# EAGLE design MySimpleRFMdongle_rev2 (EAGLE 6.5.0)
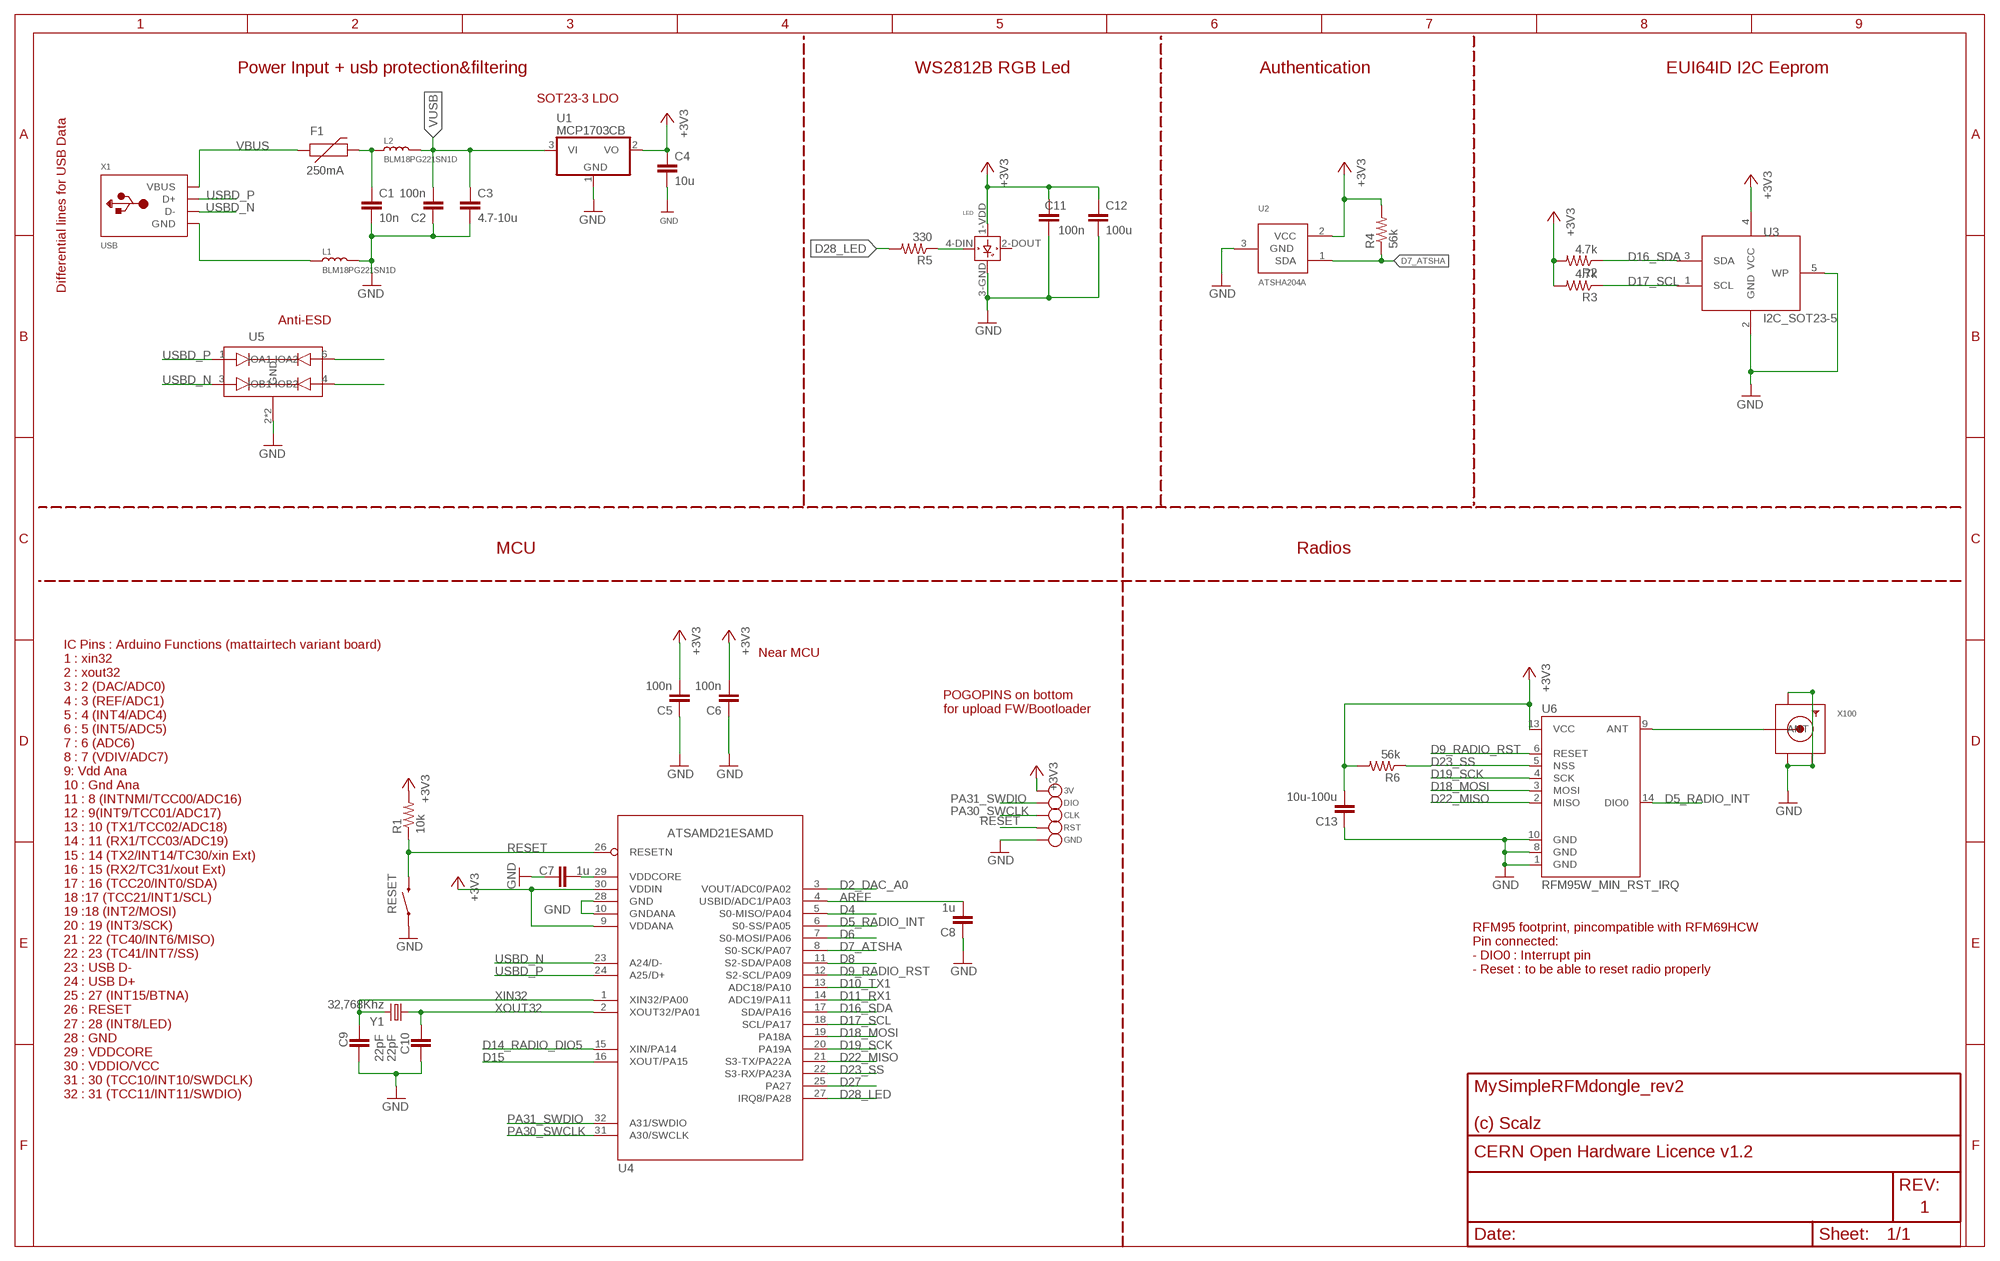
[diagram p0: schematic, sheet 1]

## Parts
3V  TESTPOINTROUND1.5MM  [TESTPOINT_ROUND_1.5MM]
C1  10n  CAP0603-CAP  [0603-CAP]
C2  100n  CAP0603-CAP  [0603-CAP]
C3  4.7-10u  CAP0805-CAP  [0805-CAP]
C4  10u  CAP0805-CAP  [0805-CAP]
C5  100n  CAP0805-CAP  [0805-CAP]
C6  100n  CAP0603-CAP  [0603-CAP]
C7  1u  CAP0805-CAP  [0805-CAP]
C8  1u  CAP0603-CAP  [0603-CAP]
C9  22pF  CAP0603-CAP  [0603-CAP]
C10  22pF  CAP0603-CAP  [0603-CAP]
C11  100n  CAP0603-CAP  [0603-CAP]
C12  100u  CAP0805-CAP  [0805-CAP]
C13  10u-100u  CAP0805-CAP  [0805-CAP]
CLK  TESTPOINTROUND1.5MM  [TESTPOINT_ROUND_1.5MM]
DIO  TESTPOINTROUND1.5MM  [TESTPOINT_ROUND_1.5MM]
F1  250mA  PTCSMD  [PTC-1206]
GND  TESTPOINTROUND1.5MM  [TESTPOINT_ROUND_1.5MM]
L1  BLM18PG221SN1D  INDUCTOR/FERRITE-BEAD-0603  [L0603]
L2  BLM18PG221SN1D  INDUCTOR/FERRITE-BEAD-0603  [L0603]
LED  WS2812B  [WS2812B]
R1  10k  RESISTOR0603-RES  [0603-RES]
R2  4.7k  RESISTOR0603-RES  [0603-RES]
R3  4.7k  RESISTOR0603-RES  [0603-RES]
R4  56k  RESISTOR0603-RES  [0603-RES]
R5  330  RESISTOR0603-RES  [0603-RES]
R6  56k  RESISTOR0603-RES  [0603-RES]
RESET  SWITCH-MOMENTARY-2-SMD-1101NE  [TACTILE-SWITCH-1101NE]
RST  TESTPOINTROUND1.5MM  [TESTPOINT_ROUND_1.5MM]
U1  MCP1703CB  [SOT23]
U2  ATSHA204A  [SOT23]
U3  I2C_SOT23-5  AT24CS32  [SOT-23-5]
U4  ATSAMD21ESAMD  [TQFP32-08]
U5  TPD2E1B06  [TPD2E1B06]
U6  RFM95W_MIN_RST_IRQ  [RFM95W_MINI_RST_IRQ]
X1  USB  [MOLEX-48037-1000]
X100  SMACONNECTOR_EDGE  [SMA_EDGELAUNCH]
Y1  32,768Khz  CRYSTAL2012  [CRYSTAL-SMD-2.0X1.2]

## Nets
+3V3: 3V.P$1 C4.1 C5.2 C6.2 C11.2 C12.1 C13.2 LED.1-VDD(VDD) R1.2 R2.2 R3.2 R4.2 R6.2 U1.2(VO) U2.2(VCC) U3.4(VCC) U4.9(VDDANA) U4.30(VDDIN) U6.13(VCC)
AREF: C8.2 U4.4(USBID/ADC1/PA03)
D2_DAC_A0: U4.3(VOUT/ADC0/PA02)
D4: U4.5(S0-MISO/PA04)
D5_RADIO_INT: U4.6(S0-SS/PA05) U6.14(DIO0)
D6: U4.7(S0-MOSI/PA06)
D7_ATSHA: R4.1 U2.1(SDA) U4.8(S0-SCK/PA07)
D8: U4.11(S2-SDA/PA08)
D9_RADIO_RST: U4.12(S2-SCL/PA09) U6.6(RESET)
D10_TX1: U4.13(ADC18/PA10)
D11_RX1: U4.14(ADC19/PA11)
D14_RADIO_DIO5: U4.15(XIN/PA14)
D15: U4.16(XOUT/PA15)
D16_SDA: R2.1 U3.3(SDA) U4.17(SDA/PA16)
D17_SCL: R3.1 U3.1(SCL) U4.18(SCL/PA17)
D18_MOSI: U4.19(PA18A) U6.3(MOSI)
D19_SCK: U4.20(PA19A) U6.4(SCK)
D22_MISO: U4.21(S3-TX/PA22A) U6.2(MISO)
D23_SS: R6.1 U4.22(S3-RX/PA23A) U6.5(NSS)
D27: U4.25(PA27)
D28_LED: R5.2 U4.27(IRQ8/PA28)
GND: C1.2 C2.1 C3.2 C4.2 C5.1 C6.1 C7.1 C8.1 C9.1 C10.1 C11.1 C12.2 C13.1 GND.P$1 L1.2 LED.3-GND(GND) RESET.P$1 U1.1(GND) U2.3(GND) U3.2(GND) U3.5(WP) U4.10(GNDANA) U4.28(GND) U5.2(GND) U5.5(GND) U6.1(GND) U6.8(GND) U6.10(GND) X100.GND@1(GND4) X100.GND@2(GND3) X100.GND@3(GND2) X100.GND@4(GND1)
N$10: C1.1 F1.2 L2.1
N$12: LED.4-DIN(DIN) R5.1
N$23: U6.9(ANT) X100.P(ANT)
PA30_SWCLK: CLK.P$1 U4.31(A30/SWCLK)
PA31_SWDIO: DIO.P$1 U4.32(A31/SWDIO)
RESET: R1.1 RESET.P$2 RST.P$1 U4.26(RESETN)
USBD_N: U4.23(A24/D-) U5.3(IOB1) U5.4(IOB2) X1.2(D-)
USBD_P: U4.24(A25/D+) U5.1(IOA1) U5.6(IOA2) X1.3(D+)
USBGND: L1.1 X1.4(GND)
VBUS: F1.1 X1.1(VBUS)
VDDCORE: C7.2 U4.29(VDDCORE)
VUSB: C2.2 C3.1 L2.2 U1.3(VI)
XIN32: C9.2 U4.1(XIN32/PA00) Y1.2
XOUT32: C10.2 U4.2(XOUT32/PA01) Y1.1
Unconnected: LED.2-DOUT(DOUT)

## Notes on the sheet
- Power Input + usb protection&filtering | WS2812B RGB Led | Authentication | EUI64ID I2C Eeprom
- SOT23-3 LDO
- Differential lines for USB Data
- Anti-ESD
- MCU | Radios
- Near MCU
- POGOPINS on bottom
  for upload FW/Bootloader
- RFM95 footprint, pincompatible with RFM69HCW
  Pin connected:
  - DIO0 : Interrupt pin
  - Reset : to be able to reset radio properly
- IC Pins : Arduino Functions (mattairtech variant board)
  1 : xin32
  2 : xout32
  3 : 2 (DAC/ADC0)
  4 : 3 (REF/ADC1)
  5 : 4 (INT4/ADC4)
  6 : 5 (INT5/ADC5)
  7 : 6 (ADC6)
  8 : 7 (VDIV/ADC7)
  9: Vdd Ana
  10 : Gnd Ana
  11 : 8 (INTNMI/TCC00/ADC16)
  12 : 9(INT9/TCC01/ADC17)
  13 : 10 (TX1/TCC02/ADC18)
  14 : 11 (RX1/TCC03/ADC19)
  15 : 14 (TX2/INT14/TC30/xin Ext) 
  16 : 15 (RX2/TC31/xout Ext) 
  17 : 16 (TCC20/INT0/SDA)
  18 :17 (TCC21/INT1/SCL)
  19 :18 (INT2/MOSI)
  20 : 19 (INT3/SCK)
  21 : 22 (TC40/INT6/MISO)
  22 : 23 (TC41/INT7/SS)
  23 : USB D- 
  24 : USB D+
  25 : 27 (INT15/BTNA)
  26 : RESET
  27 : 28 (INT8/LED)
  28 : GND
  29 : VDDCORE
  30 : VDDIO/VCC
  31 : 30 (TCC10/INT10/SWDCLK)
  32 : 31 (TCC11/INT11/SWDIO)

## Library data of the parts
3V CLK DIO GND RST = microbuilder:TESTPOINT: Test Point Various test points for characterisation and PCB testing TESTPOINT_SMT - Compact Surface Mount Test Point [Digikey: 5016KTR-ND]
C1-C13 = LowPowerLab:CAP: Capacitor Standard 0603 ceramic capacitor, and 0.1" leaded capacitor.
F1 = SparkFun-PowerIC:PTC: Resettable Fuse PTC Resettable Fuse. Spark Fun Electronics SKU : COM-08357; PROD_ID: RES-11150
L1 L2 = Discrete:INDUCTOR/FERRITE-BEAD
LED = adafruit:WS2812B
R1-R6 = LowPowerLab:RESISTOR: Resistor Basic schematic elements and footprints for 0603, 1206, and PTH resistors.
RESET = SparkFun:SWITCH-MOMENTARY-2
U1 = linear:MCP1703: 250 mA, 16V, Low Quiescent Current LDO Regulator Source: http://ww1.microchip.com/downloads/en/DeviceDoc/22049b.pdf
U2 = rfmdongle:ATSHA204A
U3 = rfmdongle:AT24CS32
U4 = atsamd21E:ATSAMD21E
U5 = rfm_dongle:TPD2E1B06
U6 = rfm_dongle:RFM95W_MIN_RST_IRQ
X1 = todstuff:USB
X100 = rfmdongle:SMACONNECTOR: SMA Connector 90° DIP SMA Connector, 50 Ohm (4UConnector: 07259)
Y1 = SparkFun-FreqCtrl:CRYSTAL: Various standard crystals. Proven footprints. Spark Fun Electronics SKU : COM-00534

## Net classes
0 default: width 0.203 mm, clearance 0.203 mm
1 power: width 0.508 mm, clearance 0.356 mm
2 gnd: width 0.152 mm, drill 0.305 mm, clearance 0.152 mm
4 USBpair: width 0.152 mm, drill 0.305 mm, clearance 0.152 mm

## Board
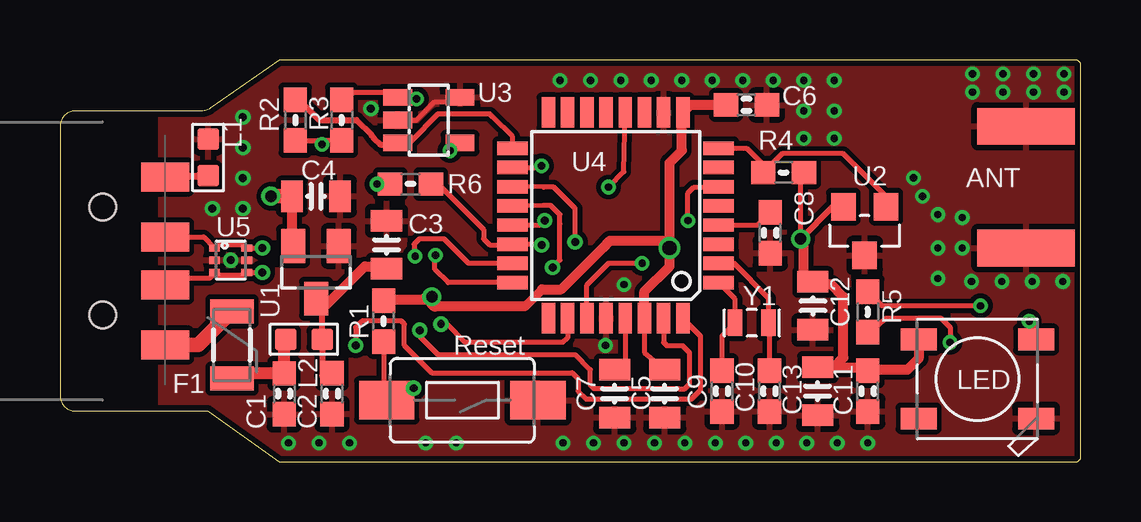
[diagram p1: board, top side]
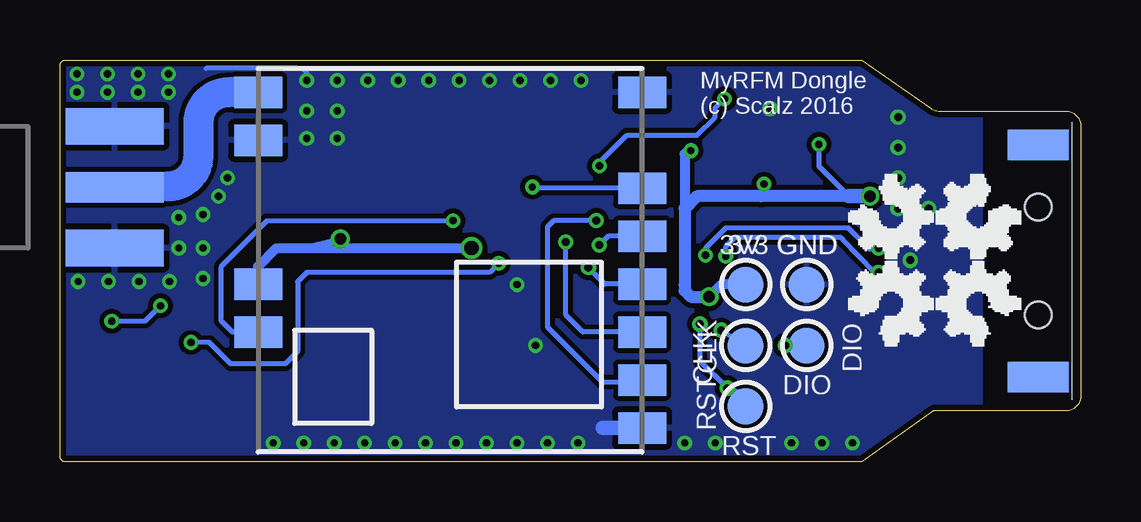
[diagram p2: board, bottom side, seen from below]

Size 42.54 x 16.77 mm. Coordinates in mm from the lower left corner, seen from the top.
Outline: 0,14.01 0,2.76 arc90 0.64,2.13 6.16,2.13 9.14,0 42.29,0 arc90 42.54,0.25 42.54,16.52 arc90 42.29,16.77 9.14,16.77 6.26,14.76 arc-35 5.9,14.64 0.64,14.64 arc90 0,14.01
Copper layers (1*16): Top 0.035mm / dielectric 1.5mm / Bottom 0.035mm
Design rules "SeeedStudio_2layer_DRU_no_angle_20140221": minimum track width 6mil, minimum drill 12mil, track to track 6mil, track to pad 6mil, pad to pad 6mil, via to via 6mil, smd to smd 0mil, copper to edge 10mil, drill to drill 10mil, minimum pad ring 10mil, minimum via ring 6mil, stop-mask expansion 2mil, vias tented up to drill 100mil, thermal gap 10mil

### Footprints (pad centres in the part's own frame; a part is rotated, then mirrored left to right if it is on the bottom)
TESTPOINT_ROUND_1.5MM = smd 1.5 x 1.5: P$1 0,0
0603-CAP = smd 1.016 x 0.965: 1 -0.85,0; 2 0.85,0
0805-CAP = smd 0.902 x 1.3: 1 -1,0; 2 1,0
PTC-1206 = smd 1 x 1.8: 1 -1.4,0; 2 1.4,0
L0603 = smd 0.889 x 0.889: 1 -0.762,0; 2 0.762,0
WS2812B = smd 1.5 x 0.9: 1-VDD 2.45,-1.65; 2-DOUT 2.45,1.65; 3-GND -2.45,1.65; 4-DIN -2.45,-1.65
0603-RES = smd 1.016 x 0.965: 1 -0.85,0; 2 0.85,0
TACTILE-SWITCH-1101NE = smd 2.3 x 1.6: P$1 -3.15,0; P$2 3.15,0
SOT23 = smd 1 x 1.4: 1 -0.95,-1.1; 2 0.95,-1.1; 3 0,1.1
SOT23' = smd 1.016 x 1.143: 1 -0.889,-1.016; 2 0.889,-1.016; 3 0,1.016
SOT-23-5 = smd 0.69 x 1.2: 1 -0.95,-1.3; 2 0,-1.3; 3 0.95,-1.3; 4 0.95,1.3; 5 -0.95,1.3
TQFP32-08 = smd 1.27 x 0.559: 1 -4.293,2.8; 2 -4.293,2; 3 -4.293,1.2; 4 -4.293,0.4; 5 -4.293,-0.4; 6 -4.293,-1.2; 7 -4.293,-2; 8 -4.293,-2.8; 17 4.293,-2.8; 18 4.293,-2; 19 4.293,-1.2; 20 4.293,-0.4; 21 4.293,0.4; 22 4.293,1.2; 23 4.293,2; 24 4.293,2.8 | smd 0.559 x 1.27: 9 -2.8,-4.293; 10 -2,-4.293; 11 -1.2,-4.293; 12 -0.4,-4.293; 13 0.4,-4.293; 14 1.2,-4.293; 15 2,-4.293; 16 2.8,-4.293; 25 2.8,4.293; 26 2,4.293; 27 1.2,4.293; 28 0.4,4.293; 29 -0.4,4.293; 30 -1.2,4.293; 31 -2,4.293; 32 -2.8,4.293
TPD2E1B06 = smd 0.297 x 0.45: 1 -0.513,-0.675; 2 0,-0.675; 3 0.513,-0.675; 4 0.513,0.675; 5 0,0.675; 6 -0.513,0.675
RFM95W_MINI_RST_IRQ = smd 2 x 1.3: 1 -8,7; 2 -8,5; 3 -8,3; 4 -8,1; 5 -8,-1; 6 -8,-3; 8 -8,-7; 9 8,-7; 10 8,-5; 13 8,1; 14 8,3
MOLEX-48037-1000 = smd 2 x 1.2: 1 2.6,-3.5; 2 2.6,-1; 3 2.6,1; 4 2.6,3.5 | smd 2.54 x 1.27 bottom: P$1 0,4.85; P$2 0,-4.85 | hole 1.1: 0,2.25; 0,-2.25
SMA_EDGELAUNCH = smd 4.064 x 1.524: GND@1 2.032,-2.54; GND@2 2.032,2.54 | smd 4.064 x 1.524 bottom: GND@3 2.032,2.54; GND@4 2.032,-2.54 | smd 4.064 x 1.27: P 2.032,0
CRYSTAL-SMD-2.0X1.2 = smd 0.6 x 1.1: 1 -0.7,0; 2 0.7,0

### Placement (x,y rotation side)
3V  13.97,7.4 0 bottom
C1  9.34,2.85 270 top
C2  11.33,2.85 90 top
C3  13.6,9.06 90 top
C4  10.67,11.09 0 top
C5  25.2,2.86 90 top
C6  28.6,14.89 180 top
C7  23.11,2.86 90 top
C8  29.59,9.56 90 top
C9  27.58,2.96 90 top
C10  29.57,2.96 90 top
C11  33.66,2.96 90 top
C12  31.37,6.51 270 top
C13  31.57,2.96 90 top
CLK  13.97,4.86 0 bottom
DIO  11.43,4.86 0 bottom
F1  7.16,4.88 270 top
GND  11.43,7.4 0 bottom
L1  6.17,12.71 90 top
L2  10.16,5.12 0 top
LED  38.23,3.46 180 top
R1  13.49,5.88 90 top
R2  9.8,14.26 270 top
R3  11.73,14.26 270 top
R4  30.15,12.08 0 top
R5  33.66,6.26 270 top
R6  14.61,11.59 180 top
RESET  16.76,2.58 180 top
RST  13.97,2.32 0 bottom
U1  10.67,7.91 180 top
U2  ATSHA204A  [SOT23']  33.53,9.64 180 top
U3  15.37,14.26 270 top
U4  23.15,10.29 180 top
U5  7.11,8.42 270 top
U6  26.29,8.42 180 bottom
U$2  [OPENHW_SMALL_OSHPARK]  2.54,4.86 0 top
X1  1.78,8.38 0 top
X100  42.29,11.47 0 bottom
Y1  28.83,5.8 180 top

### Tracks (layer width: path | path; a pad name or v marks a point on that pad's centre or on a via)
+3V3  (via drill 0.3, 0.48, 0.6)
  Top 0.203: R2.2 10.76,13.41 v10.92,13.24 11.09,13.41 R3.2 | R6.2 13.46,11.47 v13.21,11.59 | 16.58,13.31 16.58,13.18 v16.26,12.99 | U4.30 24.35,4.57 C5.2 | v30.86,9.31 30.86,11.94 R4.2
  Top 0.254: U3.4 16.58,13.31 | U2.2 32.21,10.65 v30.86,9.31
  Top 0.381: 19.41,6.51 20.09,7.2
  Top 0.406: 15.62,6.51 19.41,6.51 | 20.09,7.2 20.88,7.2 22.61,8.93 22.91,9.23 25.09,9.23 v25.4,8.93 | v15.49,6.89 15.24,6.89 15.24,6.77 13.65,6.77 R1.2 | U4.30 24.35,7.12 25.4,8.16 v25.4,8.93 | v25.4,8.93 25.4,12.48 25.91,12.99 25.91,14.54 U4.9 26.27,14.89 C6.2 | LED.1-VDD 35.78,4.32 35.31,3.85 33.69,3.85 C11.2 33.51,3.96 C13.2 32.24,3.96 32.64,4.35 32.64,6.89 32.13,7.4 31.48,7.4 C12.1 31.39,7.51 30.99,7.91 30.99,9.05 v30.86,9.31 | U1.2 9.67,9.01 C4.1
  Top 0.508: v15.49,6.89 15.49,6.64 15.62,6.51
  Top 0.61: C4.1 v8.79,11.09
  Bottom 0.203: v30.86,9.31 32.38,8.93 | 34.42,7.78 34.42,7.91 34.29,7.91 | v10.92,13.24 10.92,12.34 C4.1 | v13.21,11.59 13.21,11.21 13.34,11.09
  Bottom 0.406: U6.13 34.29,7.91 34.29,8.16 33.53,8.93 32.38,8.93 v25.4,8.93 | 3V.P$1 14.99,7.4 v15.49,6.89 | v16.26,12.99 16.38,12.99 16.51,12.86 16.51,10.58
  Bottom 0.508: C4.1 13.34,11.09 16,11.09 16.51,10.58 16.51,7.4 16.51,7.15 16.26,6.89 v15.49,6.89
  Bottom 0.61: v8.79,11.09 C4.1
AREF
  Top 0.203: U4.4 29.07,9.89 C8.2
D5_RADIO_INT  (via drill 0.3)
  Top 0.203: v26.16,10.07 26.16,11.21 26.42,11.47 27.42,11.47 U4.6
  Bottom 0.203: U6.14 35.35,5.42 35.81,5.88 35.81,8.16 34.04,9.94 33.91,10.07 v26.16,10.07
D7_ATSHA
  Top 0.203: U4.8 28.61,13.09 29.21,12.48 29.21,12.16 R4.1 30.09,12.86 32.64,12.86 34.8,10.7 U2.1
D9_RADIO_RST  (via drill 0.3)
  Top 0.203: v22.86,11.47 23.5,12.11 U4.12
  Bottom 0.203: U6.6 22.81,11.42 v22.86,11.47
D16_SDA
  Top 0.203: U4.17 18.86,13.56 18.03,14.39 17.91,14.51 15.75,14.51 14.61,13.37 14.13,13.37 U3.3
  Top 0.254: R2.1 9.95,15.11 10.79,14.26 12.34,14.26 12.98,13.62 13.08,13.5 13.34,13.24 14,13.24 U3.3
D17_SCL  (via drill 0.3)
  Top 0.203: U4.18 20,12.29 v20.07,12.36 | v14.86,15.15 14.13,15.15 U3.1 14.04,15.21 13.84,15.4 12.23,15.4 R3.1
  Bottom 0.203: v20.07,12.36 20.07,12.48 19.81,12.74 18.92,13.62 16,13.62 15.24,14.39 15.24,14.77 v14.86,15.15
D18_MOSI  (via drill 0.33)
  Top 0.203: U4.19 20.15,11.47 20.57,11.47 21.21,10.83 21.46,10.58 v21.46,9.18
  Bottom 0.203: U6.3 20.75,5.42 21.46,6.13 v21.46,9.18
D19_SCK  (via drill 0.33)
  Top 0.203: U4.20 20.15,10.7 20.45,10.7 20.83,10.32 20.83,9.94 20.83,8.42 v20.52,8.11
  Bottom 0.203: U6.4 19.83,7.42 19.94,7.53 v20.52,8.11
D22_MISO  (via drill 0.33)
  Top 0.203: U4.21 20.01,9.89 v20.19,10.07
  Bottom 0.203: v20.19,10.07 21.97,10.07 22.23,9.81 22.23,5.62 19.94,3.34 18.37,3.34 U6.2
D23_SS  (via drill 0.33)
  Top 0.203: v20.07,9.05 20.03,9.09 U4.22 18.83,9.05 17.91,9.05 17.65,9.31 17.65,9.69 15.88,11.47 R6.1
  Bottom 0.203: U6.5 19.7,9.42 v20.07,9.05
D28_LED  (via drill 0.3)
  Top 0.203: U4.27 21.95,7.38 22.86,8.29 v24.26,8.29 | R5.2 33.82,5.41 34.29,5.88 34.42,6 36.7,6 37.08,5.62 v37.08,4.99
  Bottom 0.203: v24.26,8.29 24.64,7.91 32.26,7.91 32.64,7.53 32.64,4.61 33.15,4.1 35.43,4.1 36.07,4.74 36.32,4.99 v37.08,4.99
GND  (via drill 0.3, 0.33 pad 0.64)
  Top 0.203: U3.2 14.86,14.26 15.62,15.02 16.48,15.02 U3.5
  Bottom 0.203: 36.45,16.42 32.64,16.42 32.51,16.42 arc90 32.26,16.16 v32.26,15.91
  Bottom 0.61: U6.1 17.67,1.42 19.92,1.42
  other vias: 7.11,8.42 23.5,7.4 7.62,14.39 7.62,13.12 7.62,11.85 7.62,10.58 6.35,10.58 12.95,14.74 22.73,4.86 41.83,16.19 37.59,10.2 37.59,8.93 41.78,7.53 40.51,7.53 39.24,7.53 37.97,7.53 36.58,10.32 32.26,14.64 32.26,13.5 30.99,15.91 30.99,14.64 30.99,13.5 33.66,0.8 32.38,0.8 31.11,0.8 29.84,0.8 28.57,0.8 27.3,0.8 26.04,0.8 24.77,0.8 23.5,0.8 22.23,0.8 20.95,0.8 29.72,15.91 28.45,15.91 27.18,15.91 25.91,15.91 24.64,15.91 23.37,15.91 22.1,15.91 20.83,15.91 16.51,0.8 15.24,0.8 9.53,0.8 10.79,0.8 12.06,0.8 40.56,16.19 39.29,16.19 38.02,16.19 36.58,8.93 35.94,11.09 35.56,11.85 41.83,15.43 40.56,15.43 39.29,15.43 38.02,15.43 36.58,7.66
  pour Bottom (isolate 0.203, rank 6): 0,-3.14 0,25.81 42.67,25.81 42.67,-3.14
  pour Top (isolate 0.203, rank 6): 0,-3.14 0,26.32 43.18,26.32 43.18,-3.14
N$1
  cutout Top: 0,1.94 0,14.01 arc-90 0.64,14.64 4.06,14.64 4.06,1.94
N$4
  cutout Bottom: -0.51,1.43 -0.51,13.64 arc-90 0.49,14.64 4.06,14.64 4.06,1.43
N$10
  Top 0.508: F1.2 7.5,3.69 C1.1 9.34,5.06 L2.1
N$12  (via drill 0.3)
  Top 0.203: LED.4-DIN 40.68,5.59 v40.39,5.88 | v38.35,6.51 34.25,6.51 R5.1
  Bottom 0.203: v40.39,5.88 38.99,5.88 v38.35,6.51
N$23
  Bottom 0.203: X100.P 38.08,11.47 arc-90 38.05,11.49
  Bottom 1.24: U6.9 35.51,15.42 arc-90 36.78,14.15 36.78,12.76 arc90 38.05,11.49
PA30_SWCLK  (via drill 0.33)
  Top 0.203: U4.31 25.15,4.98 25.27,4.86 25.93,4.86 26.24,4.56 26.24,3.26 26.04,3.06 25.78,3.06 22.86,3.06 22.25,3.06 22.1,3.21 22.1,3.85 21.46,4.48 17.78,4.48 15.75,4.48 14.99,5.24 v14.99,5.5
  Bottom 0.203: v14.99,5.5 CLK.P$1
PA31_SWDIO  (via drill 0.33)
  Top 0.203: U4.32 26.7,5.25 26.7,3.01 26.31,2.63 21.92,2.63 21.59,2.96 21.59,3.46 21.34,3.72 15.49,3.72 14.35,4.86 14.35,5.75 14.22,5.88 12.57,5.88 12.32,5.62 v12.32,4.86
  Bottom 0.203: v12.32,4.86 DIO.P$1
RESET  (via drill 0.33)
  Top 0.203: RESET.P$2 RST.P$1 v14.73,3.08 | U4.26 21.15,5.18 20.95,4.99 16.89,4.99 16.13,5.75 v15.88,5.75 | RESET.P$2 | R1.1 13.49,2.7 RESET.P$2
  Bottom 0.203: RST.P$1 13.97,2.83 v14.73,3.08 15.88,4.23 v15.88,5.75
USBD_N  (via drill 0.3, 0.33 pad 0.64)
  Top 0.203: v8.43,7.91 7.95,7.9 U5.4 7.74,7.9 7.62,7.78 6.56,7.78 U5.3 6.44,7.87 6.22,7.66 4.65,7.66 X1.2 | U4.23 17.02,8.29 16,9.31 14.97,9.31 14.76,9.09 14.76,8.67 v14.8,8.58
  Bottom 0.203: v8.43,7.91 8.59,7.91 9.92,9.29 9.99,9.36 14.35,9.36 14.42,9.36 14.8,8.98 v14.8,8.58
USBD_P  (via drill 0.3, 0.33 pad 0.64)
  Top 0.203: X1.3 5.98,9.38 U5.1 6.56,9.05 7.62,9.05 7.74,8.93 U5.6 8.55,8.93 v8.43,8.93 | 19.4,7.49 U4.24 16.17,7.49 15.62,8.04 15.62,8.61 v15.65,8.63
  Bottom 0.203: 8.51,8.88 8.81,8.88 9.38,9.45 9.7,9.76 14.35,9.76 14.79,9.76 15.64,8.93 v15.65,8.63
  Bottom 0.254: 8.51,8.88 v8.43,8.93
USBGND
  Top 0.305: X1.4 4.78,11.88 L1.1
VBUS
  Top 0.61: X1.1 5.77,4.88 F1.1
VDDCORE
  Top 0.203: U4.29 23.55,4.14 C7.2
VUSB
  Top 0.254: C2.2 10.92,3.61 L2.2 10.92,6.56 U1.3
  Top 0.406: 10.92,6.56 11.09,6.56 12.7,8.16 13.5,8.16 C3.1
XIN32
  Top 0.203: U4.1 28.13,6.8 Y1.2 27.58,5.26 C9.2
XOUT32
  Top 0.203: U4.2 28.07,8.29 29.53,6.83 Y1.1 29.57,5.49 C10.2

### Text on the board
tPlace: ANT | Reset
bPlace: MyRFM Dongle / (c) Scalz 2016 | GND | 3V3 | DIO | CLK | RST